# EAGLE design first (EAGLE 9.2.2)
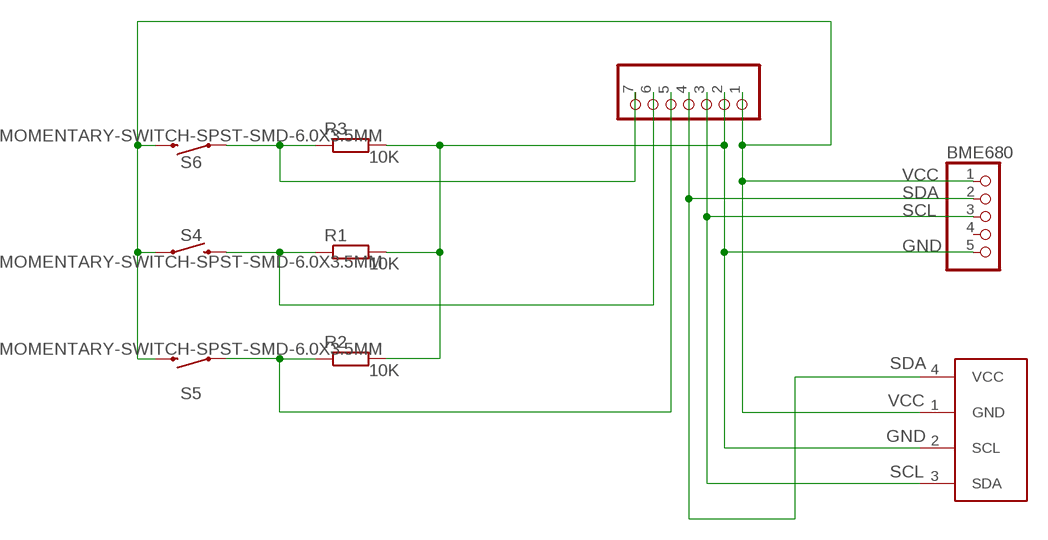
[diagram p0: schematic, sheet 1]

## Parts
BME680  PINHD-1X5  [1X05]
R1  R-EU_M1206  [M1206]
R2  R-EU_M1206  [M1206]
R3  R-EU_M1206  [M1206]
S4  MOMENTARY-SWITCH-SPST-SMD-6.0X3.5MM  [TACTILE_SWITCH_SMD_6.0X3.5MM]
S5  MOMENTARY-SWITCH-SPST-SMD-6.0X3.5MM  [TACTILE_SWITCH_SMD_6.0X3.5MM]
S6  MOMENTARY-SWITCH-SPST-SMD-6.0X3.5MM  [TACTILE_SWITCH_SMD_6.0X3.5MM]
SDA  PINHD-1X7  [1X07]
U$1  I2C_OLED  [I2C_OLED_PACKAGE]

## Nets
B1: R2.1 S5.1 SDA.5
B2: R1.1 S4.2 SDA.6
B3: R3.1 S6.1 SDA.7
GND: BME680.5 R1.2 R2.2 R3.2 SDA.2 U$1.2(SCL)
N$4: BME680.2 SDA.4 U$1.4(VCC)
SCL: BME680.3 SDA.3 U$1.3(SDA)
VCC: BME680.1 S4.1 S5.2 S6.2 SDA.1 U$1.1(GND)
Unconnected: BME680.4

## Notes on the sheet
- VCC
- SDA
- SCL
- GND
- SDA
- VCC
- GND
- SCL

## Library data of the parts
BME680 = pinhead:PINHD-1X5: PIN HEADER
R1-R3 = rcl:R-EU_: RESISTOR, European symbol; SPICEPREFIX: 10K
S4-S6 = SparkFun-Switches:MOMENTARY-SWITCH-SPST: Momentary Switch (Pushbutton) - SPST Normally-open (NO) SPST momentary switches (buttons, pushbuttons). Variants PTH-12MM - 12mm square, through-hole Momentary Pushbutton Switch - 12mm Square <https://www.sparkfun.com/products/9190> (COM-09190) PTH-6.0MM, PTH-6.0MM-KIT - 6.0mm square, through-hole Mini Pushbutton Switch <https://www.sparkfun.com/products/97> (COM-00097) KIT package intended for soldering kit's - only one side of pads' copper is exposed. PTH-RIGHT-ANGLE-KIT - Right-angle, through-hole Right Angle Tactile Button <https://www.sparkfun.com/products/10791> - Used on SparkFun BigTime Watch Kit <https://www.sparkfun.com/products/11734> SMD-12MM - 12mm square, surface-mount Tactile Button - SMD (12mm) <https://www.sparkfun.com/products/12993> (COM-12993) Used on SparkFun PicoBoard <https://www.sparkfun.com/products/11888> SMD-4.5MM - 4.5mm Square Trackball Switch Used on SparkFun Blackberry Trackballer Breakout <https://www.sparkfun.com/products/13169> SMD-4.6MMX2.8MM - 4.60mm x 2.80mm, surface mount Used on SparkFun SAMD21 Mini Breakout <https://www.sparkfun.com/products/13664> SMD-5.2MM, SMD-5.2-REDUNDANT - 5.2mm square, surface-mount Mini Pushbutton Switch - SMD <https://www.sparkfun.com/products/8720> (COM-08720) Used on Arduino Pro Mini <https://www.sparkfun.com/products/11114> REDUNDANT package connects both switch circuits together SMD-6.0X3.5MM - 6.0 x 3.5mm, surface mount Momentary Reset Switch SMD <https://www.sparkfun.com/products/8229> (COM-08229) SMD-6.2MM-TALL - 6.2mm square, surface mount Tactile Button - SMD (6mm) <https://www.sparkfun.com/products/12992> Used on SparkFun Digital Sandbox <https://www.sparkfun.com/products/12651> SMD-RIGHT-ANGLE - Right-angle, surface mount Used on SparkFun Block for Intel® Edison - Arduino <https://www.sparkfun.com/products/13036>; PROD_ID: SWCH-00815; SF_SKU: COM-08229
SDA = pinhead:PINHD-1X7: PIN HEADER
U$1 = DIYMall_OLED:I2C_OLED

## Board
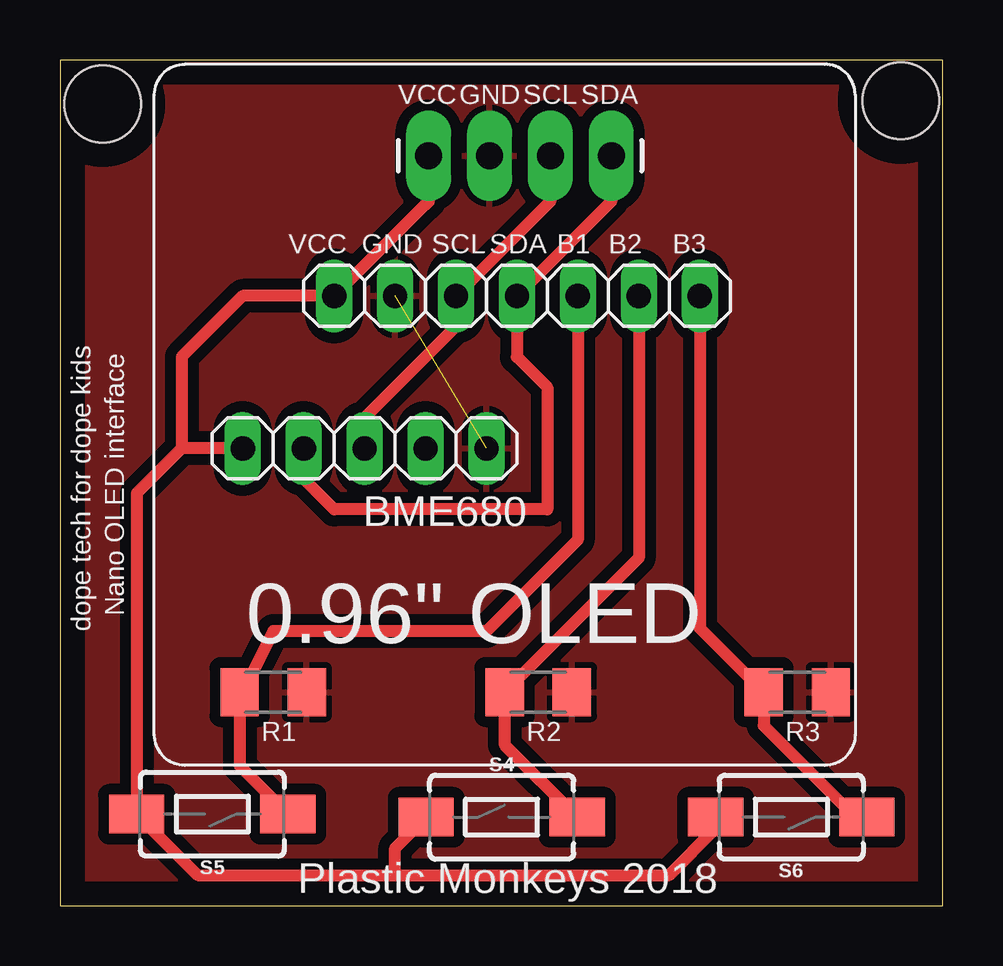
[diagram p1: board, top side]

Size 36.81 x 35.23 mm. Coordinates in mm from the lower left corner, seen from the top.
Outline: 0,0 36.81,0 36.81,35.23 0,35.23 0,0
Copper layers (1*16): Top 0.035mm / dielectric 1.5mm / Bottom 0.035mm
Design rules "default": minimum track width 6mil, minimum drill 0.35mm, track to track 6mil, track to pad 6mil, pad to pad 6mil, via to via 6mil, smd to smd 6mil, copper to edge 40mil, drill to drill 6mil, minimum pad ring 10mil, minimum via ring 8mil, stop-mask expansion 4mil, vias tented up to drill 0mil, thermal gap 10mil
Holes 3.2 mm at 1.78,33.4 35.05,33.53

### Footprints (pad centres in the part's own frame; a part is rotated, then mirrored left to right if it is on the bottom)
1X05 = drill 1.016 long: 1 -5.08,0; 2 -2.54,0; 3 0,0; 4 2.54,0; 5 5.08,0
M1206 = smd 1.6 x 2: 1 -1.4,0; 2 1.4,0
TACTILE_SWITCH_SMD_6.0X3.5MM = smd 2.3 x 1.6: 1 -3.15,0; 2 3.15,0
1X07 = drill 1.016 long: 1 -7.62,0; 2 -5.08,0; 3 -2.54,0; 4 0,0; 5 2.54,0; 6 5.08,0; 7 7.62,0
I2C_OLED_PACKAGE = drill 1.118 pad 1.88 long: 1 0,0; 2 2.54,0; 3 5.08,0; 4 7.62,0

### Placement (x,y rotation side)
BME680  12.7,19.05 0 top
R1  19.94,8.89 0 top
R2  8.89,8.89 0 top
R3  30.73,8.89 0 top
S4  18.41,3.68 0 top
S5  6.35,3.81 180 top
S6  30.48,3.68 180 top
SDA  19.05,25.4 0 top
U$1  15.37,31.24 0 top

### Tracks (layer width: path | path; a pad name or v marks a point on that pad's centre or on a via)
B1
  Top 0.152: R2.1 7.55,8.82 7.62,8.89
  Top 0.508: SDA.5 21.59,15.24 17.78,11.43 8.89,11.43 7.62,8.89 | R2.1 7.49,5.82 S5.1
B2
  Top 0.508: SDA.6 24.13,14.48 R1.1 18.54,6.71 S4.2
B3
  Top 0.508: SDA.7 26.67,11.55 R3.1 29.33,7.5 33.15,3.68 S6.1
GND  (1 unrouted)
  pour Top (isolate 0.457): 0,0 36.83,0 36.83,35.56 0,35.56
N$4
  Top 0.152: 22.99,29.34 22.86,29.21
  Top 0.508: 22.86,29.21 SDA.4 19.05,22.86 20.32,21.59 20.32,16.51 11.43,16.51 10.16,17.78 BME680.2 | U$1.4 22.99,29.34
SCL
  Top 0.152: SDA.3 16.51,24.13 | 12.7,20.32 BME680.3
  Top 0.508: U$1.3 20.45,29.34 SDA.3 | 16.51,24.13 12.7,20.32
VCC
  Top 0.152: 15.37,29.34 15.24,29.21
  Top 0.508: 5.08,19.05 5.08,22.86 7.62,25.4 SDA.1 15.24,29.21 | U$1.1 15.37,29.34 | BME680.1 5.08,19.05 | 5.08,19.05 3.2,17.17 S5.2 5.74,1.27 13.97,1.27 | 13.97,1.27 13.97,2.39 S4.1 | 13.97,1.27 25.4,1.27 27.33,3.2 S6.2

### Text on the board
tNames: VCC | GND | SCL | SDA | VCC | GND | SCL | SDA | B1 | B2 | B3 | Nano OLED interface | dope tech for dope kids | R1 | R2 | R3 | Plastic Monkeys 2018